# Altium project Tracking_GPS_V1.0.PrjPCB
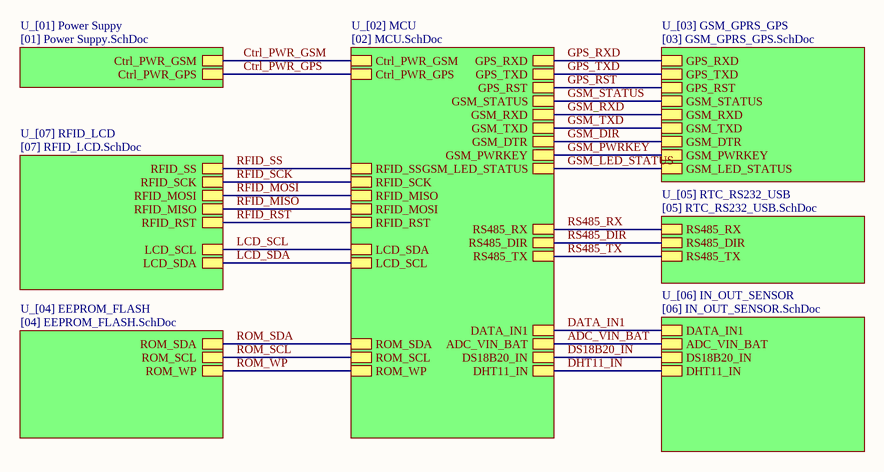
[diagram p0: GPS_Tracking_V1.0.SchDoc]
8 sheets, 174 parts. Net scope: hierarchical (ports join the sheet entries above them; power ports are global).
Board file: PCB1.PcbDoc
Sheets:
  GPS_Tracking_V1.0.SchDoc
    U_[01] Power Suppy = [01] Power Suppy.SchDoc
    U_[03] GSM_GPRS_GPS = [03] GSM_GPRS_GPS.SchDoc
    U_[04] EEPROM_FLASH = [04] EEPROM_FLASH.SchDoc
    U_[05] RTC_RS232_USB = [05] RTC_RS232_USB.SchDoc
    U_[07] RFID_LCD = [07] RFID_LCD.SchDoc
    U_[02] MCU = [02] MCU.SchDoc
    U_[06] IN_OUT_SENSOR = [06] IN_OUT_SENSOR.SchDoc

## Sheet GPS_Tracking_V1.0.SchDoc
size A4

### Sub-sheets
U_[01] Power Suppy = [01] Power Suppy.SchDoc: Ctrl_PWR_GSM, Ctrl_PWR_GPS
U_[02] MCU = [02] MCU.SchDoc: GSM_STATUS, GSM_DTR, GSM_PWRKEY, DATA_IN1, GPS_RXD, GPS_TXD, GPS_RST, Ctrl_PWR_GPS, GSM_RXD, GSM_TXD, Ctrl_PWR_GSM, RS485_TX, RS485_RX, RS485_DIR, ADC_VIN_BAT, DHT11_IN, DS18B20_IN, GSM_LED_STATUS, RFID_SS, RFID_SCK, RFID_MISO, RFID_MOSI, RFID_RST, LCD_SDA, LCD_SCL, ROM_SDA, ROM_SCL, ROM_WP
U_[03] GSM_GPRS_GPS = [03] GSM_GPRS_GPS.SchDoc: GPS_RXD, GPS_TXD, GPS_RST, GSM_STATUS, GSM_RXD, GSM_TXD, GSM_DTR, GSM_PWRKEY, GSM_LED_STATUS
U_[04] EEPROM_FLASH = [04] EEPROM_FLASH.SchDoc: ROM_SDA, ROM_SCL, ROM_WP
U_[05] RTC_RS232_USB = [05] RTC_RS232_USB.SchDoc: RS485_RX, RS485_DIR, RS485_TX
U_[06] IN_OUT_SENSOR = [06] IN_OUT_SENSOR.SchDoc: DATA_IN1, ADC_VIN_BAT, DS18B20_IN, DHT11_IN
U_[07] RFID_LCD = [07] RFID_LCD.SchDoc: RFID_SS, RFID_SCK, RFID_MOSI, RFID_MISO, RFID_RST, LCD_SCL, LCD_SDA

### Nets
ADC_VIN_BAT: sheet U_[02] MCU/ADC_VIN_BAT, sheet U_[06] IN_OUT_SENSOR/ADC_VIN_BAT
Ctrl_PWR_GPS: sheet U_[01] Power Suppy/Ctrl_PWR_GPS, sheet U_[02] MCU/Ctrl_PWR_GPS
Ctrl_PWR_GSM: sheet U_[01] Power Suppy/Ctrl_PWR_GSM, sheet U_[02] MCU/Ctrl_PWR_GSM
DATA_IN1: sheet U_[02] MCU/DATA_IN1, sheet U_[06] IN_OUT_SENSOR/DATA_IN1
DHT11_IN: sheet U_[02] MCU/DHT11_IN, sheet U_[06] IN_OUT_SENSOR/DHT11_IN
DS18B20_IN: sheet U_[02] MCU/DS18B20_IN, sheet U_[06] IN_OUT_SENSOR/DS18B20_IN
GPS_RST: sheet U_[03] GSM_GPRS_GPS/GPS_RST, sheet U_[02] MCU/GPS_RST
GPS_RXD: sheet U_[03] GSM_GPRS_GPS/GPS_RXD, sheet U_[02] MCU/GPS_RXD
GPS_TXD: sheet U_[03] GSM_GPRS_GPS/GPS_TXD, sheet U_[02] MCU/GPS_TXD
GSM_DIR: sheet U_[03] GSM_GPRS_GPS/GSM_DTR, sheet U_[02] MCU/GSM_DTR
GSM_LED_STATUS: sheet U_[03] GSM_GPRS_GPS/GSM_LED_STATUS, sheet U_[02] MCU/GSM_LED_STATUS
GSM_PWRKEY: sheet U_[03] GSM_GPRS_GPS/GSM_PWRKEY, sheet U_[02] MCU/GSM_PWRKEY
GSM_RXD: sheet U_[03] GSM_GPRS_GPS/GSM_RXD, sheet U_[02] MCU/GSM_RXD
GSM_STATUS: sheet U_[03] GSM_GPRS_GPS/GSM_STATUS, sheet U_[02] MCU/GSM_STATUS
GSM_TXD: sheet U_[03] GSM_GPRS_GPS/GSM_TXD, sheet U_[02] MCU/GSM_TXD
LCD_SCL: sheet U_[07] RFID_LCD/LCD_SCL, sheet U_[02] MCU/LCD_SDA
LCD_SDA: sheet U_[07] RFID_LCD/LCD_SDA, sheet U_[02] MCU/LCD_SCL
RFID_MISO: sheet U_[07] RFID_LCD/RFID_MISO, sheet U_[02] MCU/RFID_MOSI
RFID_MOSI: sheet U_[07] RFID_LCD/RFID_MOSI, sheet U_[02] MCU/RFID_MISO
RFID_RST: sheet U_[07] RFID_LCD/RFID_RST, sheet U_[02] MCU/RFID_RST
RFID_SCK: sheet U_[07] RFID_LCD/RFID_SCK, sheet U_[02] MCU/RFID_SCK
RFID_SS: sheet U_[07] RFID_LCD/RFID_SS, sheet U_[02] MCU/RFID_SS
ROM_SCL: sheet U_[04] EEPROM_FLASH/ROM_SCL, sheet U_[02] MCU/ROM_SCL
ROM_SDA: sheet U_[04] EEPROM_FLASH/ROM_SDA, sheet U_[02] MCU/ROM_SDA
ROM_WP: sheet U_[04] EEPROM_FLASH/ROM_WP, sheet U_[02] MCU/ROM_WP
RS485_DIR: sheet U_[05] RTC_RS232_USB/RS485_DIR, sheet U_[02] MCU/RS485_DIR
RS485_RX: sheet U_[05] RTC_RS232_USB/RS485_RX, sheet U_[02] MCU/RS485_RX
RS485_TX: sheet U_[05] RTC_RS232_USB/RS485_TX, sheet U_[02] MCU/RS485_TX

## Sheet [01] Power Suppy.SchDoc
size A4
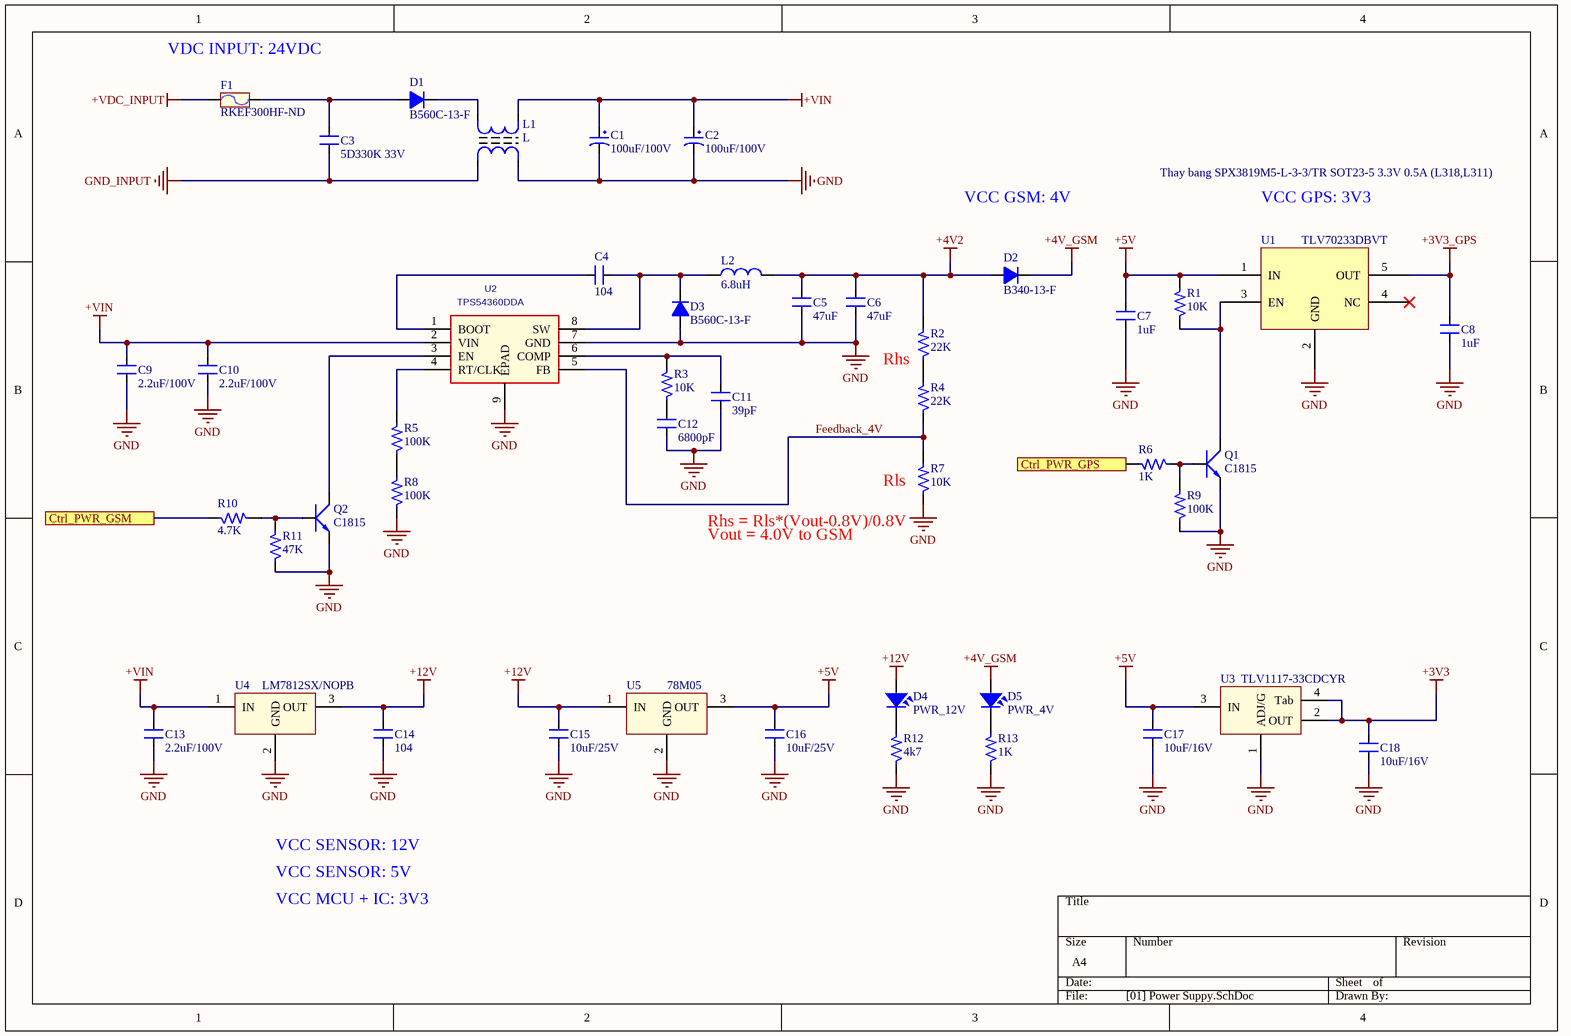
[diagram p1: [01] Power Suppy.SchDoc]

### Parts
C1  100uF/100V  [CP1.5/3.4]
C2  100uF/100V  [CP1.5/3.4]
C3  5D330K 33V  [CN2]
C4  104  [C0603 SMT]
C5  47uF  [SM-1210]
C6  47uF  [SM-1210]
C7  1uF  [SM-1210]
C8  1uF  [SM-1210]
C9  2.2uF/100V  [SM-1210]
C10  2.2uF/100V  [SM-1210]
C11  39pF  [CAP_0805]
C12  6800pF  [CAP_0805]
C13  2.2uF/100V  [SM-1210]
C14  104  [CAP_0805]
C15  10uF/25V  [CAP_0805]
C16  10uF/25V  [CAP_0805]
C17  10uF/16V  [CAP_0805]
C18  10uF/16V  [CAP_0805]
D1  B560C-13-F  [DO-214AB SMC]
D2  B340-13-F  [DO-214AB SMA]
D3  B560C-13-F  [DO-214AB SMC]
D4  PWR_12V  [LED-0805-Yellow]
D5  PWR_4V  [LED-0805-Green]
F1  RKEF300HF-ND  [FUSE2]
L1  L  [L2 UF9.8]
L2  6.8uH  [L01 SMD 12*12*6]
Q1  C1815  [SOT23B]
Q2  C1815  [SOT23B]
R1  10K  [R0603 -SMT]
R2  22K  [RES-SMD-0805]
R3  10K  [RES-SMD-0805]
R4  22K  [RES-SMD-0805]
R5  100K  [RES-SMD-0805]
R6  1K  [R0603 -SMT]
R7  10K  [RES-SMD-0805]
R8  100K  [RES-SMD-0805]
R9  100K  [R0603 -SMT]
R10  4.7K  [RES-SMD-0805]
R11  47K  [RES-SMD-0805]
R12  4k7  [RES-SMD-0805]
R13  1K  [RES-SMD-0805]
U1  TLV70233DBVT  [TLV70233_3.3V]
U2  TPS54360DDA  [DDA8_3P1X2P4-M]
U3  TLV1117-33CDCYR  [SOT223-4N]
U4  LM7812SX/NOPB  [TO-263-4]
U5  78M05  [TO252-3L]

### Ports
Ctrl_PWR_GPS, Ctrl_PWR_GSM

### Nets
+3V3: C18.2 U3.2(OUT) U3.4(Tab)
+3V3_GPS: C8.2 U1.5(OUT)
+4V2: C5.2 C6.2 D2.1(A) L2.2 R2.2
+4V_GSM: D2.2(K) D5.1
+5V: C7.2 C16.2 C17.2 R1.2 U1.1(IN) U3.3(IN) U5.3(OUT)
+12V: C14.2 C15.2 D4.1 U4.3(OUT) U5.1(IN)
+VDC_INPUT: F1.1
+VIN: C1.1 C2.1 C9.2 C10.2 C13.2 L1.3 U2.2(VIN) U4.1(IN)
GND: C1.2 C2.2 C5.1 C6.1 C7.1 C8.1 C9.1 C10.1 C11.1 C12.1 C13.1 C14.1 C15.1 C16.1 C17.1 C18.1 D3.1(A) L1.2 Q1.1(E) Q2.1(E) R7.1 R8.1 R9.1 R11.1 R12.1 R13.1 U1.2(GND) U2.7(GND) U2.9(EPAD) U3.1(ADJ/G) U4.2(GND) U5.2(GND)
GND_INPUT: C3.1 L1.1
Ctrl_PWR_GPS: R6.2 ; port Ctrl_PWR_GPS
Ctrl_PWR_GSM: R10.1 ; port Ctrl_PWR_GSM
Feedback_4V: R4.1 R7.2 U2.5(FB)
NetC3_2: C3.2 D1.1(A) F1.2
NetC4_1: C4.1 U2.1(BOOT)
NetC4_2: C4.2 D3.2(K) L2.1 U2.8(SW)
NetC11_2: C11.2 R3.2 U2.6(COMP)
NetC12_2: C12.2 R3.1
NetD1_2: D1.2(K) L1.4
NetD4_2: D4.2 R12.2
NetD5_2: D5.2 R13.2
NetQ1_2: Q1.2(C) R1.1 U1.3(EN)
NetQ1_3: Q1.3(B) R6.1 R9.2
NetQ2_2: Q2.2(C) U2.3(EN)
NetQ2_3: Q2.3(B) R10.2 R11.2
NetR2_1: R2.1 R4.2
NetR5_1: R5.1 R8.2
NetR5_2: R5.2 U2.4(RT/CLK)

Not connected (* = marked no-connect by the designer): U1 4(NC)*

### Notes on the sheet
- (near F1) VDC INPUT: 24VDC
- Thay bang SPX3819M5-L-3-3/TR SOT23-5 3.3V 0.5A (L318,L311)
- VCC GSM: 4V
- VCC GPS: 3V3
- Rhs
- (near R7) Rls
- (near R7) Rhs = Rls*(Vout-0.8V)/0.8V
- Vout = 4.0V to GSM
- VCC SENSOR: 12V
- VCC SENSOR: 5V
- VCC MCU + IC: 3V3

### Library data of the parts
C1 C2 = CP3: Cap 100uF/35V - 470uF/16V; Value: 100uF/35V/50V; Description 1: 1000uF/6,3V - 470uF/16V - 330uF - 25V; Description 2: 220uF/35V - 100uF/50V - 63V - 4,7uF/200V; Description 3: 22uF => 33uF100V - 3,3uF => 4,7uF/250V; Description 4: 2,2uF =>3,3uF/350 - 2,2uF/400V - 1uF/450V
C3 = CN: Value: 0,1uF/300V; Designed by: VanDungEvn
C4-C8 C11 C12 C14-C18 = CM_1: Cap SMD; Value: 103
C9 C10 C13 = CM: CAP CER 2.2UF 100V X7R 1210  445-4498-2-ND; Value: 103
D1 D3 = D5A: DIODE SCHOTTKY 60V 5A SMC; Value: 1N5408
D2 = D1A: DIODE SCHOTTKY 40V 3A SMC; Value: 1N4007
D4 D5 = LED: LED Single colour Green and Red; Value: LED 3 ly Single Colour
F1 = Fuse: PTC RESET FUSE 60V 3A RADIAL; Designed by: VanDungEvn; Value: Fuse
L1 = L2x220: Inductor; Value: Loc 220; Designed by: VanDungEvn
L2 = L1: FIXED IND 6.2UH 5.7A 22.4 MOHM; Value: 150 mH
Q1 Q2 = C1815: NPN 600mW, ECB; Value: C1815
R1-R5 R7-R12 = RM: Resistor SMD; Value: 1K
R6 R13 = RM: Resistor SMD; Value: 1K
U1 = TLV70233_3.3V
U2 = TPS54360DDA: REG BUCK SPLIT RAIL 8SOPWRPAD; C: Copyright (C) 2015 Accelerated Designs. All rights reserved; Vendor: TEXAS INSTRUMENTS; Built_By: EMA_UL_Team; Value: TPS54360DDA; Manufacturer_Part_Number: TPS54360DDA
U3 = LM1117: 3v3; Value: LM317
U4 = LM78xx_1: Value: LM7805
U5 = LM78xx: On ap +, from + 5 to + 24VDC; Value: LM7805

## Sheet [03] GSM_GPRS_GPS.SchDoc
size A4
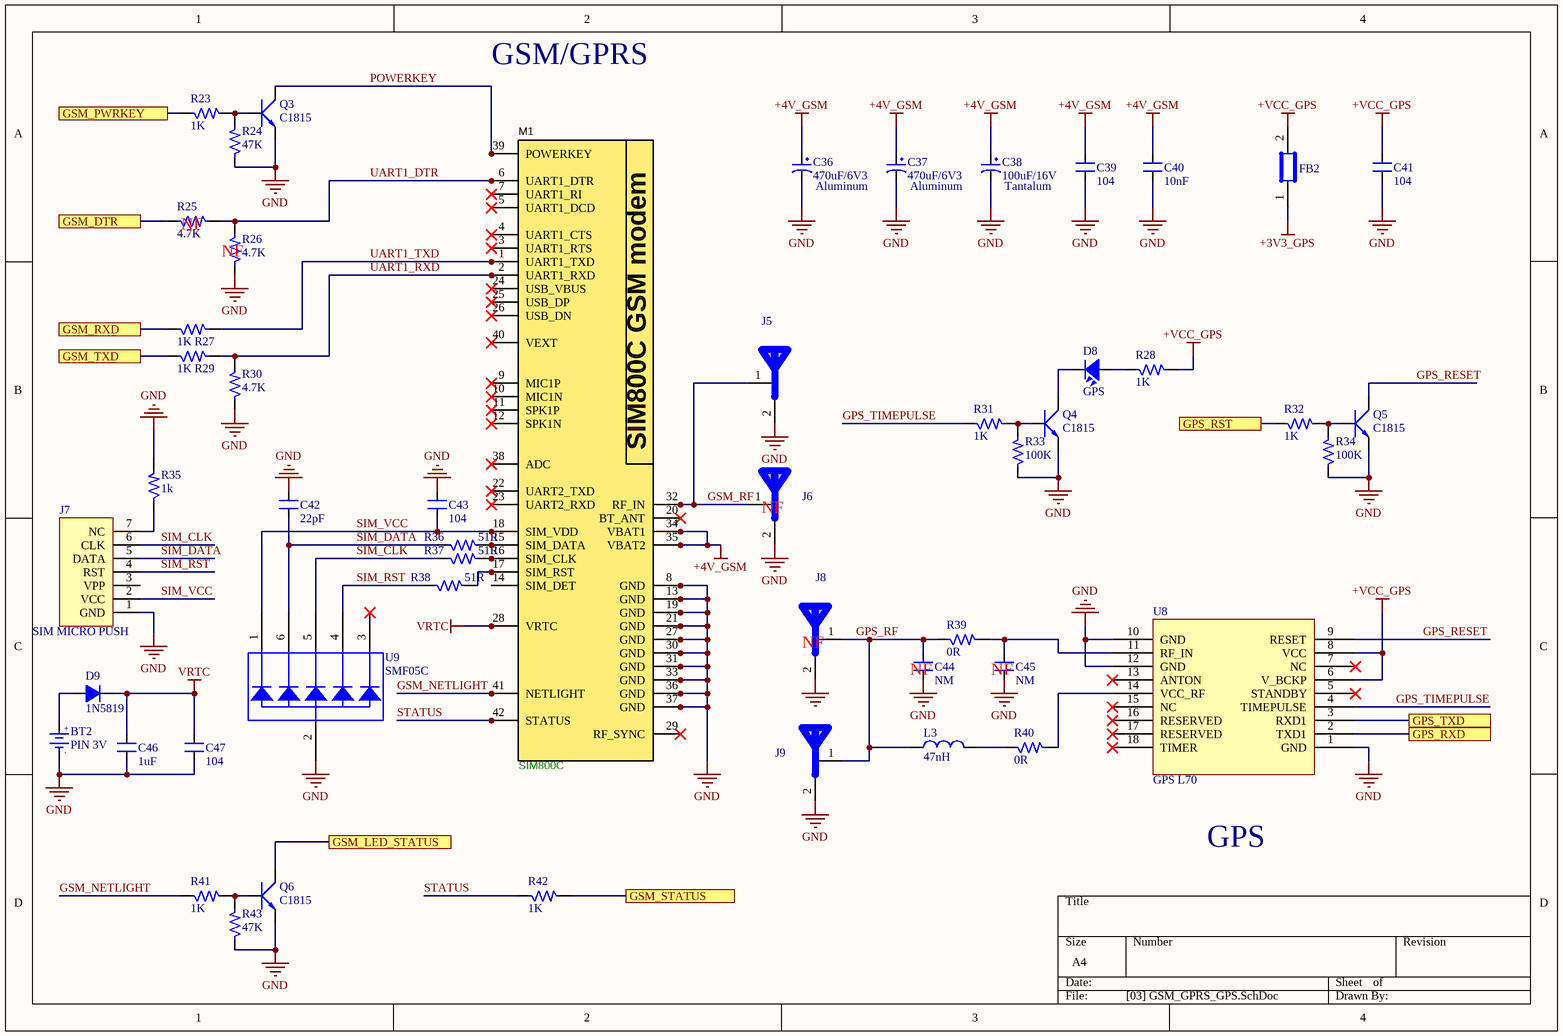
[diagram p2: [03] GSM_GPRS_GPS.SchDoc]

### Parts
(Parts that share a designator on the sheet are numbered #1, #2 ... from top to bottom, then left to right.)
BT2  PIN 3V  [CR1220 SMD]
C36  470uF/6V3  [C_Alu_6.3x7.7]
C37  470uF/6V3  [C_Alu_6.3x7.7]
C38  100uF/16V  [C_7343_40]
C39  104  [CAP_0805]
C40  10nF  [CAP_0805]
C41  104  [CAP_0805]
C42  22pF  [C0603 SMT]
C43  104  [C0603 SMT]
C44  NM  [C0603 SMT]
C45  NM  [C0603 SMT]
C46  1uF  [C0603 SMT]
C47  104  [C0603 SMT]
D8  GPS  [LED-0805-Red]
D9  1N5819  [SOD123]
FB2  BLM21PG600SN1D  [R0805]  (value not drawn)
J5  GPS_ANTENNA  [Antenna-MCX5.08-H5]  (value not drawn)
J6  GSM  [Antenna-IPEX]  (value not drawn)
J7  SIM MICRO PUSH  [MICRO_SIM_HOLDER]
J8  GPS  [Antenna-IPEX]  (value not drawn)
J9#1  GPS_ANTENNA  [Antenna-MCX5.08-H5]  (value not drawn)
L3  47nH  [C0805]
M1  SIM800C  [SIM800C]
Q3  C1815  [SOT23B]
Q4  C1815  [SOT23B]
Q5  C1815  [SOT23B]
Q6  C1815  [SOT23B]
R23  1K  [R0603 -SMT]
R24  47K  [R0603 -SMT]
R25  4.7K  [R0603 -SMT]
R26  4.7K  [R0603 -SMT]
R27  1K  [R0603 -SMT]
R28  1K  [RES-SMD-0805]
R29  1K  [R0603 -SMT]
R30  4.7K  [R0603 -SMT]
R31  1K  [RES-SMD-0805]
R32  1K  [RES-SMD-0805]
R33  100K  [RES-SMD-0805]
R34  100K  [RES-SMD-0805]
R35  1k  [RES-SMD-0805]
R36  51R  [R0603 -SMT]
R37  51R  [R0603 -SMT]
R38  51R  [R0603 -SMT]
R39  0R  [R0603 -SMT]
R40  0R  [R0603 -SMT]
R41  1K  [R0603 -SMT]
R42  1K  [R0603 -SMT]
R43  47K  [R0603 -SMT]
U8  GPS L70  [GPS L70]
U9  SMF05C  [SOT_363_6]

### Ports
GPS_RST, GPS_RXD, GPS_TXD, GSM_DTR, GSM_LED_STATUS, GSM_PWRKEY, GSM_RXD, GSM_STATUS, GSM_TXD

### Nets
+3V3_GPS: FB2.1
+4V_GSM: C36.1 C37.1 C38.1 C39.1 C40.1 M1.34(VBAT1) M1.35(VBAT2)
+VCC_GPS: C41.2 FB2.2 R28.2 U8.6(V_BCKP) U8.8(VCC)
GND: BT2.2(GND) C36.2 C37.2 C38.2 C39.2 C40.2 C41.1 C42.2 C43.2 C44.1 C45.1 C46.1 C47.1 J5.2(GND) J6.2(GND) J7.1(GND) J8.2(GND) J9#1.2(GND) M1.8(GND) M1.13(GND) M1.19(GND) M1.21(GND) M1.27(GND) M1.30(GND) M1.31(GND) M1.33(GND) M1.36(GND) M1.37(GND) Q3.1(E) Q4.1(E) Q5.1(E) Q6.1(E) R24.1 R26.1 R30.1 R33.1 R34.1 R35.2 R43.1 U8.1(GND) U8.10(GND) U8.12(GND) U9.2(A)
VRTC: C46.2 C47.2 D9.2(K) M1.28(VRTC)
GPS_RESET: Q5.2(C) U8.9(RESET)
GPS_RF: C44.2 J8.1(GND) J9#1.1(GND) L3.1 R39.1
GPS_RST: R32.1 ; port GPS_RST
GPS_RXD: U8.2(TXD1) ; port GPS_RXD
GPS_TIMEPULSE: R31.1 U8.4(TIMEPULSE)
GPS_TXD: U8.3(RXD1) ; port GPS_TXD
GSM_DIR: R25.1 ; port GSM_DTR
GSM_LED_STATUS: Q6.2(C) ; port GSM_LED_STATUS
GSM_NETLIGHT: M1.41(NETLIGHT) R41.1
GSM_PWRKEY: R23.1 ; port GSM_PWRKEY
GSM_RF: J5.1(GND) J6.1(GND) M1.32(RF_IN)
GSM_RXD: R27.1 ; port GSM_RXD
GSM_STATUS: R42.2 ; port GSM_STATUS
GSM_TXD: R29.1 ; port GSM_TXD
POWERKEY: M1.39(POWERKEY) Q3.2(C)
SIM_CLK: J7.6(CLK) R37.1 U9.5(K4)
SIM_DATA: C42.1 J7.5(DATA) R36.1 U9.6(K5)
SIM_RST: J7.4(RST) R38.1 U9.4(K3)
SIM_VCC: C43.1 J7.2(VCC) M1.18(SIM_VDD) U9.1(K1)
STATUS: M1.42(STATUS) R42.1
UART1_DTR: M1.6(UART1_DTR) R25.2 R26.2
UART1_RXD: M1.2(UART1_RXD) R29.2 R30.2
UART1_TXD: M1.1(UART1_TXD) R27.2
NetBT2_1: BT2.1(+3V) D9.1(A)
NetC45_2: C45.2 R39.2 U8.11(RF_IN)
NetD8_1: D8.1 R28.1
NetD8_2: D8.2 Q4.2(C)
NetJ7_7: J7.7(NC) R35.1
NetL3_2: L3.2 R40.1
NetM1_15: M1.15(SIM_DATA) R36.2
NetM1_16: M1.16(SIM_CLK) R37.2
NetM1_17: M1.17(SIM_RST) R38.2
NetQ3_3: Q3.3(B) R23.2 R24.2
NetQ4_3: Q4.3(B) R31.2 R33.2
NetQ5_3: Q5.3(B) R32.2 R34.2
NetQ6_3: Q6.3(B) R41.2 R43.2
NetR40_2: R40.2 U8.14(VCC_RF)

Not connected (* = marked no-connect by the designer): J7 3(VPP); M1 3(UART1_RTS)* 4(UART1_CTS)* 5(UART1_DCD)* 7(UART1_RI)* 9(MIC1P)* 10(MIC1N)* 11(SPK1P)* 12(SPK1N)* 14(SIM_DET) 20(BT_ANT)* 22(UART2_TXD)* 23(UART2_RXD)* 24(USB_VBUS)* 25(USB_DP)* 26(USB_DN)* 29(RF_SYNC)* 38(ADC)* 40(VEXT)*; U8 5(STANDBY)* 7(NC)* 13(ANTON)* 15(NC)* 16(RESERVED)* 17(RESERVED)* 18(TIMER)*; U9 3(K2)*

### Notes on the sheet
- GSM/GPRS
- (near R25) NF
- (near C36) Aluminum
- (near C37) Aluminum
- (near C38) Tantalum
- (near R26) NF
- (near J6) NF
- (near J8) NF
- (near C44) NF
- (near C45) NF
- GPS
- (in symbol PIN 3V) +; -
- (in symbol SIM800C) SIM800C GSM modem

### Library data of the parts
BT2 = PIN 3V: Battery 3VDC; Value: PIN 3V
C36 C37 = C-Alu-Tantalum: Cap Aluminum; Value: 10uF/50V; Description 1: 10 => 220uF/6,3V/10V - 10uF => 100uF/16V; Description 2: 0,1uF => 33uF/50V - 10uF => 22uF/63V; Description 3: 0,47uF => 10uF/100V
C38 = C-Alu-Tantalum: Cap Tantalum 7343; Value: 10uF/50V; Description 1: 10 => 220uF/6,3V/10V - 10uF => 100uF/16V; Description 2: 0,1uF => 33uF/50V - 10uF => 22uF/63V; Description 3: 0,47uF => 10uF/100V
C39-C47 = CM: Cap SMD; Value: 103
D8 = LED: as D4 on sheet [01] Power Suppy
D9 = D1A: Diode 1A; Value: 1N4007
FB2 = Ferrite Bead
J5 J6 J8 J9#1 = ANTEN
L3 = L1: Inductor; Value: 150 mH
Q3-Q6 = C1815: NPN 600mW, ECB; Value: C1815
R23 R27-R29 R31 R32 R35 R41 R42 = RM: Resistor SMD; Value: 1K
R24-R26 R30 R33 R34 R36-R40 R43 = RM: Resistor SMD; Value: 1K
U9 = SMF05C: ESD Protection

## Sheet [04] EEPROM_FLASH.SchDoc
size A4
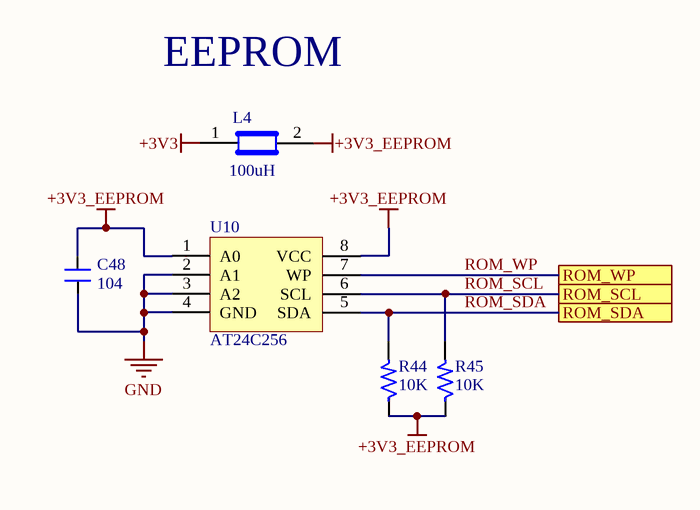
[diagram p3: [04] EEPROM_FLASH.SchDoc]

### Parts
C48  104  [C0603 SMT]
L4  100uH  [R0805]
R44  10K  [R0603 -SMT]
R45  10K  [R0603 -SMT]
U10  AT24C256  [SO-8]

### Ports
ROM_SCL, ROM_SDA, ROM_WP

### Nets
+3V3: L4.1
+3V3_EEPROM: C48.2 L4.2 R44.1 R45.1 U10.1(A0) U10.8(VCC)
GND: C48.1 U10.2(A1) U10.3(A2) U10.4(GND)
ROM_SCL: R45.2 U10.6(SCL) ; port ROM_SCL
ROM_SDA: R44.2 U10.5(SDA) ; port ROM_SDA
ROM_WP: U10.7(WP) ; port ROM_WP

### Notes on the sheet
- (near L4) EEPROM

### Library data of the parts
C48 = CM: Cap SMD; Value: 103
L4 = Ferrite Bead: 100uH 0805
R44 R45 = RM: Resistor SMD; Value: 1K
U10 = AT24Cxx

## Sheet [05] RTC_RS232_USB.SchDoc
size A4
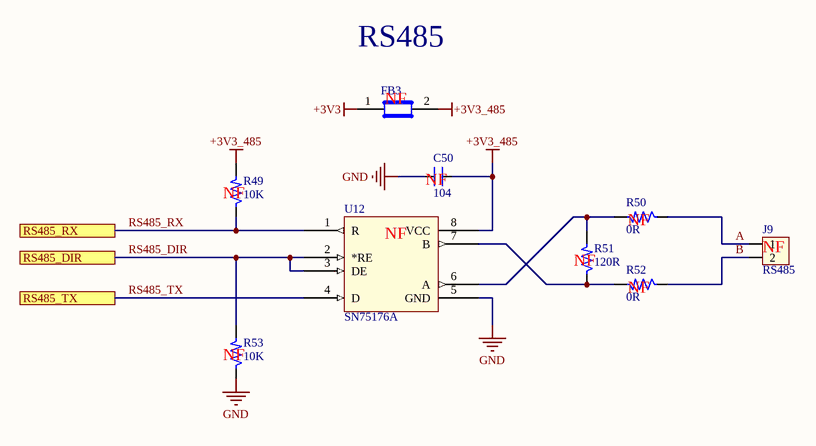
[diagram p4: [05] RTC_RS232_USB.SchDoc]

### Parts
(Parts that share a designator on the sheet are numbered #1, #2 ... from top to bottom, then left to right.)
C50  104  [CAP_0805]
FB3  BLM21PG600SN1D  [R0805]  (value not drawn)
J9#2  RS485  [Hed2V_3.96]
R49  10K  [RES-SMD-0805]
R50  0R  [RES-SMD-0805]
R51  120R  [RES-SMD-0805]
R52  0R  [RES-SMD-0805]
R53  10K  [RES-SMD-0805]
U12  SN75176A  [SN75176A]

### Ports
RS485_DIR, RS485_RX, RS485_TX

### Nets
+3V3: FB3.1
+3V3_485: C50.2 FB3.2 R49.2 U12.8(VCC)
GND: C50.1 R53.1 U12.5(GND)
A: J9#2.1 R50.1
B: J9#2.2 R52.1
RS485_DIR: R53.2 U12.2(*RE) U12.3(DE) ; port RS485_DIR
RS485_RX: R49.1 U12.1(R) ; port RS485_RX
RS485_TX: U12.4(D) ; port RS485_TX
NetR50_2: R50.2 R51.2 U12.6(A)
NetR51_1: R51.1 R52.2 U12.7(B)

### Notes on the sheet
- RS485
- (near FB3) NF
- (near R49) NF
- (near U12) NF
- (near C50) NF
- (near R50) NF
- (near R51) NF
- (near R52) NF
- (near J9#2) NF
- (near R53) NF

### Library data of the parts
C50 = CM: Cap SMD; Value: 103
FB3 = Ferrite Bead
J9#2 = Hed2: Header 2 (Green); Value: Header 2
R49-R53 = RM: Resistor SMD; Value: 1K

## Sheet [07] RFID_LCD.SchDoc
size A4
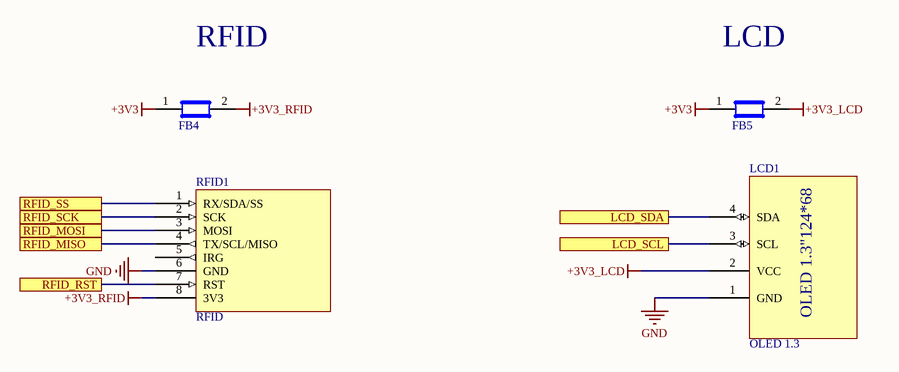
[diagram p5: [07] RFID_LCD.SchDoc]

### Parts
FB4  BLM21PG600SN1D  [R0805]  (value not drawn)
FB5  BLM21PG600SN1D  [R0805]  (value not drawn)
LCD1  OLED 1.3  [OLED 1.3]
RFID1  RFID  [RFID RC522]

### Ports
LCD_SCL, LCD_SDA, RFID_MISO, RFID_MOSI, RFID_RST, RFID_SCK, RFID_SS

### Nets
+3V3: FB4.1 FB5.1
+3V3_LCD: FB5.2 LCD1.2(VCC)
+3V3_RFID: FB4.2 RFID1.8(3V3)
GND: LCD1.1(GND) RFID1.6(GND)
LCD_SCL: LCD1.3(SCL) ; port LCD_SCL
LCD_SDA: LCD1.4(SDA) ; port LCD_SDA
RFID_MISO: RFID1.4(TX/SCL/MISO) ; port RFID_MISO
RFID_MOSI: RFID1.3(MOSI) ; port RFID_MOSI
RFID_RST: RFID1.7(RST) ; port RFID_RST
RFID_SCK: RFID1.2(SCK) ; port RFID_SCK
RFID_SS: RFID1.1(RX/SDA/SS) ; port RFID_SS

Not connected (* = marked no-connect by the designer): RFID1 5(IRG)

### Notes on the sheet
- RFID
- LCD
- (in symbol OLED 1.3) OLED 1.3"124*68

### Library data of the parts
FB4 FB5 = Ferrite Bead
RFID1 = RFID RC522

## Sheet [02] MCU.SchDoc
size A4
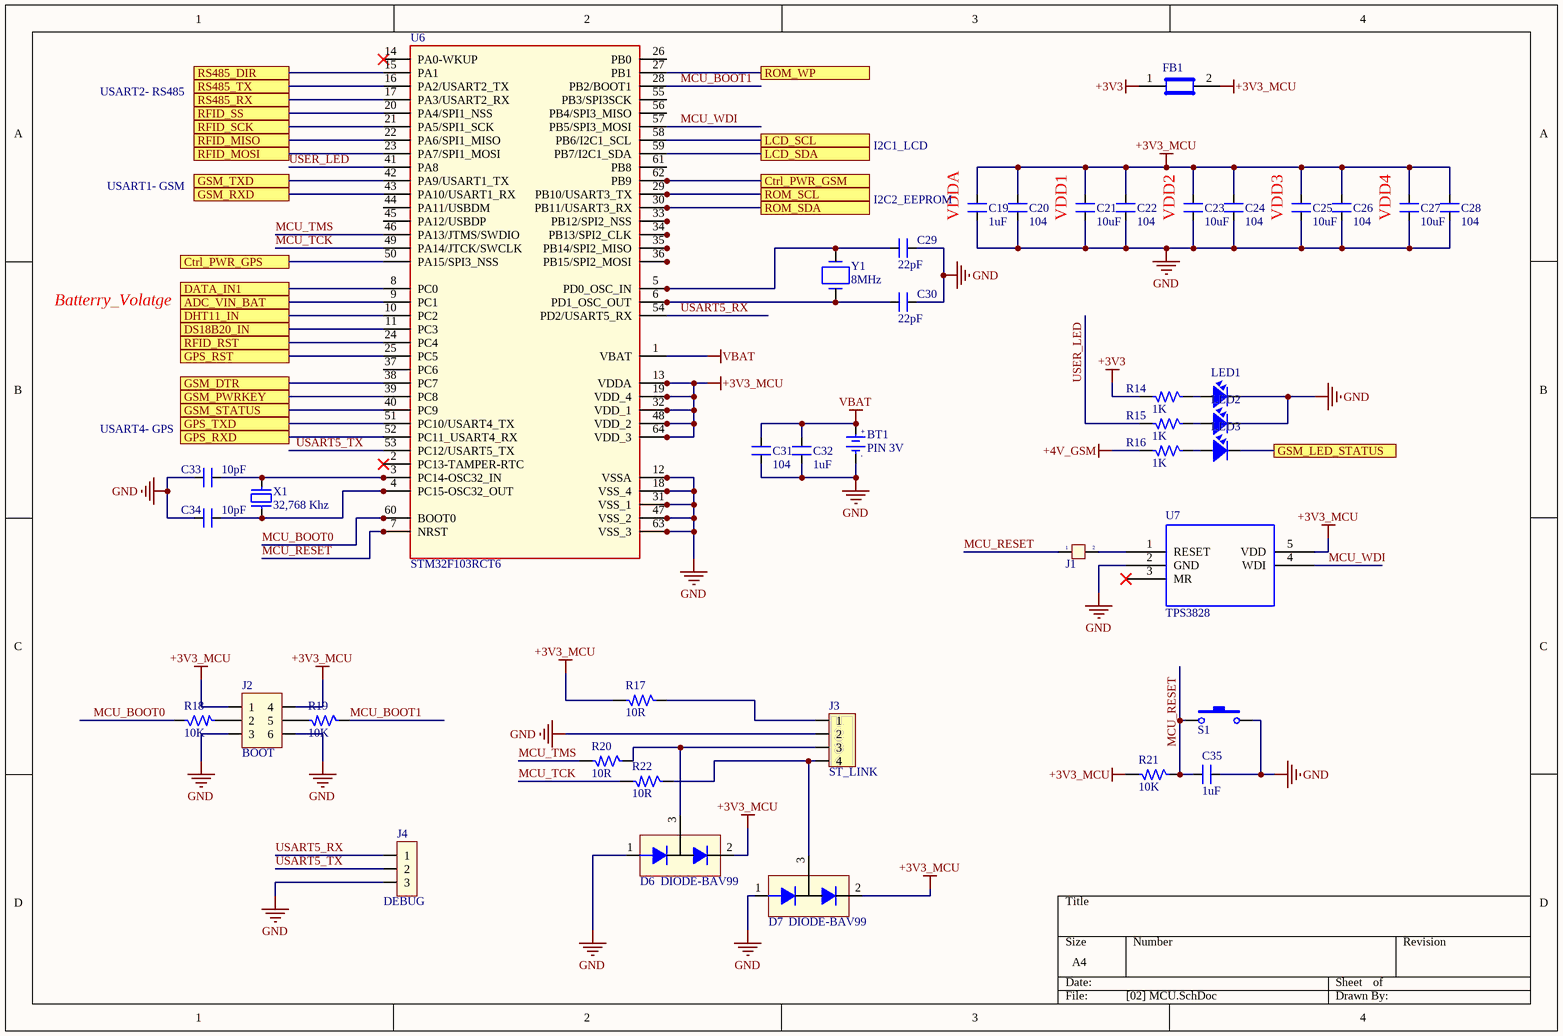
[diagram p6: [02] MCU.SchDoc]

### Parts
BT1  PIN 3V  [CR1220 SMD]
C19  1uF  [C0603 SMT]
C20  104  [C0603 SMT]
C21  10uF  [C0603 SMT]
C22  104  [C0603 SMT]
C23  10uF  [C0603 SMT]
C24  104  [C0603 SMT]
C25  10uF  [C0603 SMT]
C26  104  [C0603 SMT]
C27  10uF  [C0603 SMT]
C28  104  [C0603 SMT]
C29  22pF  [C0603 SMT]
C30  22pF  [C0603 SMT]
C31  104  [C0603 SMT]
C32  1uF  [C0603 SMT]
C33  10pF  [C0603 SMT]
C34  10pF  [C0603 SMT]
C35  1uF  [CAP_0805]
D6  DIODE-BAV99  [SOT23]
D7  DIODE-BAV99  [SOT23]
FB1  BLM21PG600SN1D  [R0805]  (value not drawn)
J1  watdog  [JP2]  (value not drawn)
J2  BOOT  [JP3x2]
J3  ST_LINK  [CON_4P]
J4  DEBUG  [JP3]
LED1  LED  [LED-0805-Green]  (value not drawn)
LED2  LED  [LED-0805-Yellow]  (value not drawn)
LED3  LED  [LED-0805-Red]  (value not drawn)
R14  1K  [RES-SMD-0805]
R15  1K  [RES-SMD-0805]
R16  1K  [RES-SMD-0805]
R17  10R  [RES-SMD-0805]
R18  10K  [R0603 -SMT]
R19  10K  [R0603 -SMT]
R20  10R  [RES-SMD-0805]
R21  10K  [RES-SMD-0805]
R22  10R  [RES-SMD-0805]
S1  SW-SMD  [SW-SMD]  (value not drawn)
U6  STM32F103RCT6  [LQFP-64]
U7  TPS3828  [TPS3828]
X1  32,768 Khz  [XT32kn]
Y1  8MHz  [ABM7_v1_1_BIG]

### Ports
ADC_VIN_BAT, Ctrl_PWR_GPS, Ctrl_PWR_GSM, DATA_IN1, DHT11_IN, DS18B20_IN, GPS_RST, GPS_RXD, GPS_TXD, GSM_DTR, GSM_LED_STATUS, GSM_PWRKEY, GSM_RXD, GSM_STATUS, GSM_TXD, LCD_SCL, LCD_SDA, RFID_MISO, RFID_MOSI, RFID_RST, RFID_SCK, RFID_SS, ROM_SCL, ROM_SDA, ROM_WP, RS485_DIR, RS485_RX, RS485_TX

### Nets
+3V3: FB1.1 R14.2
+3V3_MCU: C19.2 C20.2 C21.2 C22.2 C23.2 C24.2 C25.2 C26.2 C27.2 C28.2 D6.2 D7.2 FB1.2 J2.1 J2.4 R17.2 R21.2 U6.13(VDDA) U6.19(VDD_4) U6.32(VDD_1) U6.48(VDD_2) U6.64(VDD_3) U7.5(VDD)
+4V_GSM: R16.2
GND: BT1.2(GND) C19.1 C20.1 C21.1 C22.1 C23.1 C24.1 C25.1 C26.1 C27.1 C28.1 C29.2 C30.2 C31.1 C32.1 C33.2 C34.2 C35.2 D6.1 D7.1 J2.3 J2.6 J3.2 J4.3 LED1.2 LED2.2 S1.2 U6.12(VSSA) U6.18(VSS_4) U6.31(VSS_1) U6.47(VSS_2) U6.63(VSS_3) U7.2(GND)
VBAT: BT1.1(+3V) C31.2 C32.2 U6.1(VBAT)
ADC_VIN_BAT: U6.9(PC1) ; port ADC_VIN_BAT
Ctrl_PWR_GPS: U6.50(PA15/SPI3_NSS) ; port Ctrl_PWR_GPS
Ctrl_PWR_GSM: U6.62(PB9) ; port Ctrl_PWR_GSM
DATA_IN1: U6.8(PC0) ; port DATA_IN1
DHT11_IN: U6.10(PC2) ; port DHT11_IN
DS18B20_IN: U6.11(PC3) ; port DS18B20_IN
GPS_RST: U6.25(PC5) ; port GPS_RST
GPS_RXD: U6.52(PC11_USART4_RX) ; port GPS_RXD
GPS_TXD: U6.51(PC10/USART4_TX) ; port GPS_TXD
GSM_DIR: U6.38(PC7) ; port GSM_DTR
GSM_LED_STATUS: LED3.2 ; port GSM_LED_STATUS
GSM_PWRKEY: U6.39(PC8) ; port GSM_PWRKEY
GSM_RXD: U6.43(PA10/USART1_RX) ; port GSM_RXD
GSM_STATUS: U6.40(PC9) ; port GSM_STATUS
GSM_TXD: U6.42(PA9/USART1_TX) ; port GSM_TXD
LCD_SCL: U6.59(PB7/I2C1_SDA) ; port LCD_SDA
LCD_SDA: U6.58(PB6/I2C1_SCL) ; port LCD_SCL
MCU_BOOT0: R18.1 U6.60(BOOT0)
MCU_BOOT1: R19.1 U6.28(PB2/BOOT1)
MCU_RESET: C35.1 J1.1 R21.1 S1.1 U6.7(NRST)
MCU_TCK: R22.2 U6.49(PA14/JTCK/SWCLK)
MCU_TMS: R20.2 U6.46(PA13/JTMS/SWDIO)
MCU_WDI: U6.57(PB5/SPI3_MOSI) U7.4(WDI)
RFID_MISO: U6.23(PA7/SPI1_MOSI) ; port RFID_MOSI
RFID_MOSI: U6.22(PA6/SPI1_MISO) ; port RFID_MISO
RFID_RST: U6.24(PC4) ; port RFID_RST
RFID_SCK: U6.21(PA5/SPI1_SCK) ; port RFID_SCK
RFID_SS: U6.20(PA4/SPI1_NSS) ; port RFID_SS
ROM_SCL: U6.29(PB10/USART3_TX) ; port ROM_SCL
ROM_SDA: U6.30(PB11/USART3_RX) ; port ROM_SDA
ROM_WP: U6.27(PB1) ; port ROM_WP
RS485_DIR: U6.15(PA1) ; port RS485_DIR
RS485_RX: U6.17(PA3/USART2_RX) ; port RS485_RX
RS485_TX: U6.16(PA2/USART2_TX) ; port RS485_TX
USART5_RX: J4.1 U6.54(PD2/USART5_RX)
USART5_TX: J4.2 U6.53(PC12/USART5_TX)
USER_LED: R15.2 U6.41(PA8)
NetC29_1: C29.1 U6.5(PD0_OSC_IN) Y1.2
NetC30_1: C30.1 U6.6(PD1_OSC_OUT) Y1.1
NetC33_1: C33.1 U6.3(PC14-OSC32_IN) X1.1
NetC34_1: C34.1 U6.4(PC15-OSC32_OUT) X1.2
NetD6_3: D6.3 J3.3 R20.1
NetD7_3: D7.3 J3.4 R22.1
NetJ1_2: J1.2 U7.1(RESET)
NetJ2_2: J2.2 R18.2
NetJ2_5: J2.5 R19.2
NetJ3_1: J3.1 R17.1
NetLED1_1: LED1.1 R14.1
NetLED2_1: LED2.1 R15.1
NetLED3_1: LED3.1 R16.1

Not connected (* = marked no-connect by the designer): U6 2(PC13-TAMPER-RTC)* 14(PA0-WKUP)* 26(PB0) 33(PB12/SPI2_NSS) 34(PB13/SPI2_CLK) 35(PB14/SPI2_MISO) 36(PB15/SPI2_MOSI) 37(PC6) 44(PA11/USBDM) 45(PA12/USBDP) 55(PB3/SPI3SCK) 56(PB4/SPI3_MISO) 61(PB8); U7 3(MR)*

### Notes on the sheet
- USART2- RS485
- I2C1_LCD
- USART1- GSM
- I2C2_EEPROM
- (near C19) VDDA
- (near C21) VDD1
- (near C23) VDD2
- (near C25) VDD3
- (near C27) VDD4
- Batterry_Volatge
- USART4- GPS
- (in symbol PIN 3V) +; -

### Library data of the parts
BT1 = PIN 3V: Battery 3VDC; Value: PIN 3V
C19-C35 = CM: Cap SMD; Value: 103
D6 D7 = DIODE-BAV99: ZENER, SOT23,; Manufacturer: ON Semiconductor / Fairchild; Manufacturer Part Number: BAV99; .Creator: LeKhaLinh; Other Drawings: Diode Circuit; PCN Design/Specification: Mold Compound 12/Dec/2007; PCN Assembly/Origin: SOT23 Manufacturing Source 31/May2013 / Assembly Site Addition 20/Jul/2015; PCN Packaging: Binary Year Code Marking 15/Jan/2014; Diode Configuration: 1 Pair Series Connection; Diode Type: Standard; Voltage - DC Reverse (Vr) (Max): 70V; Current - Average Rectified (Io) (per Diode): 200mA; Voltage - Forward (Vf) (Max) @ If: 1.25V @ 150mA; Speed: Small Signal =; Reverse Recovery Time (trr): 6ns; Current - Reverse Leakage @ Vr: 2.5µA @ 70V; Online Catalog: Diode Array; Other Names: BAV99FSDKR; .CheckPCB: LeKhaLinh; .CheckSCH: LeKhaLinh; Supplier 1: Digi-Key; Stock 1: 1165; Pricing 1: 1=0.26, 10=0.21, 100=0.1115, 500=0.0734, 1000=0.0499 (USD); Standard Package: 1; Category: Discrete Semiconductor Products; Family: Diodes, Rectifiers - Arrays; Packaging: Digi-Reel®; Mounting Type: Surface Mount; Package / Case: TO-236-3, SC-59, SOT-23-3; Supplier Device Package: SOT-23-3 (TO-236); ComponentLink1URL: https://www.fairchildsemi.com/package-drawings/MA/MA03B.pdf?src-supplier=Digi-Key; ComponentLink1Description: https://www.fairchildsemi.com/package-drawings/MA/MA03B.pdf?src-supplier=Digi-Key; ComponentLink2URL: http://www.farnell.com/datasheets/1822674.pdf?src-supplier=Element14; ComponentLink2Description: http://www.farnell.com/datasheets/1822674.pdf?src-supplier=Element14; ComponentLink3URL: http://www.mouser.com/ds/2/149/BAV99-22788.pdf?src-supplier=Mouser; ComponentLink3Description: http://www.mouser.com/ds/2/149/BAV99-22788.pdf?src-supplier=Mouser; ComponentLink4URL: http://www.fairchildsemi.com/ds/BA/BAV99.pdf?src-supplier=Avnet+Europe; ComponentLink4Description: http://www.fairchildsemi.com/ds/BA/BAV99.pdf?src-supplier=Avnet+Europe; ComponentLink5URL: https://www.verical.com/server-webapp/html/getDatasheet?partID=110217&src-supplier=Verical; ComponentLink5Description: https://www.verical.com/server-webapp/html/getDatasheet?partID=110217&src-supplier=Verical; ComponentLink6URL: http://www.farnell.com/datasheets/2304409.pdf?src-supplier=Element14; ComponentLink6Description: http://www.farnell.com/datasheets/2304409.pdf?src-supplier=Element14; Supplier 2: Mouser; Stock 2: 0; Supplier 3: Arrow; Stock 3: 5700; Pricing 3: 1=0.1933, 10=0.1873, 25=0.1555, 100=0.0806, 250=0.0724, 500=0.0523, 1000=0.0428, 3000=0.0342 (USD); Supplier Part Number 1: BAV99FSCT-ND; Supplier Part Number 2: 512-BAV99; Supplier Part Number 3: BAV99
FB1 = Ferrite Bead
J1 = JP 2: Jumper 2; Value: JP 2
J2 = JP3x2: Connector 3x2; Value: Connector 3x2
J3 = Header4: Header IDC, 4 x 1 Pin Vertical 2.54mm Pitch (Non-Boxed, Male); Manufacturer: W¨¹rth Elektronik eiSos GmbH; partNo: 613002143121; ComponentLink1 Description: Manufacturer; ComponentLink2 Description: Datasheet; NoPins: 02; Created Date: 29 March 2013; ComponentLink1URL: http://www.we-online.com; ComponentLink2URL: http://katalog.we-online.de/em/datasheet/6130xx143121.pdf; Created by: Karrer Zheng
J4 = JP3: Jumper 3; Value: J3
LED1-LED3 = LED: as D4 on sheet [01] Power Suppy
R14-R16 = RM: Resistor SMD; Value: 1K
R17-R22 = RM: Resistor SMD; Value: 1K
S1 = SW-SMD: Switch; Published: 24-Mar-1999; LatestRevisionDate: 17-Jul-2002; LatestRevisionNote: Re-released for DXP Platform.; PackageReference: SPST-2; Publisher: Altium Limited
U6 = STM32F103RCT6: MCU 32BIT 256KB FLASH 64LQFP
X1 = XT32k: Crystal 32,768kHz for timer real; Value: 32,768khz
Y1 = ABM7-16.000MHZ-D2Y-T: CRYSTAL 16MHZ 18PF SMD; Manufacturer: Abracon LLC; Frequency Stability: ±30ppm; Frequency Tolerance: ±20ppm; ESR (Equivalent Series Resistance): 50 Ohm; Operating Mode: Fundamental; .Creator: MM; .Checked PCB: RF; Supplier 1: Digi-Key; Manufacturer Part Number: ABM7-16.000MHZ-D2Y-T; RoHS: RoHS Compliant; Category: Crystals and Oscillators; Stock 1: 5861; Pricing 1: 1=0.96, 10=0.847, 50=0.791, 100=0.7, 500=0.6615 (USD); Packaging: Cut Tape (CT); Type: MHz Crystal; Frequency: 16MHz; Load Capacitance: 18pF; Operating Temperature: -40°C ~ 85°C; Ratings: -; Mounting Type: Surface Mount; Package / Case: 2-SMD; Size / Dimension: 0.236" L x 0.138" W (6.00mm x 3.50mm); Height: 0.055" (1.40mm); ComponentLink1URL: http://www.abracon.com/Resonators/abm7.pdf; ComponentLink1Description: http://www.abracon.com/Resonators/abm7.pdf; Supplier Part Number 1: 535-9840-1-ND; .Checked SCH: RF

## Sheet [06] IN_OUT_SENSOR.SchDoc
size A4
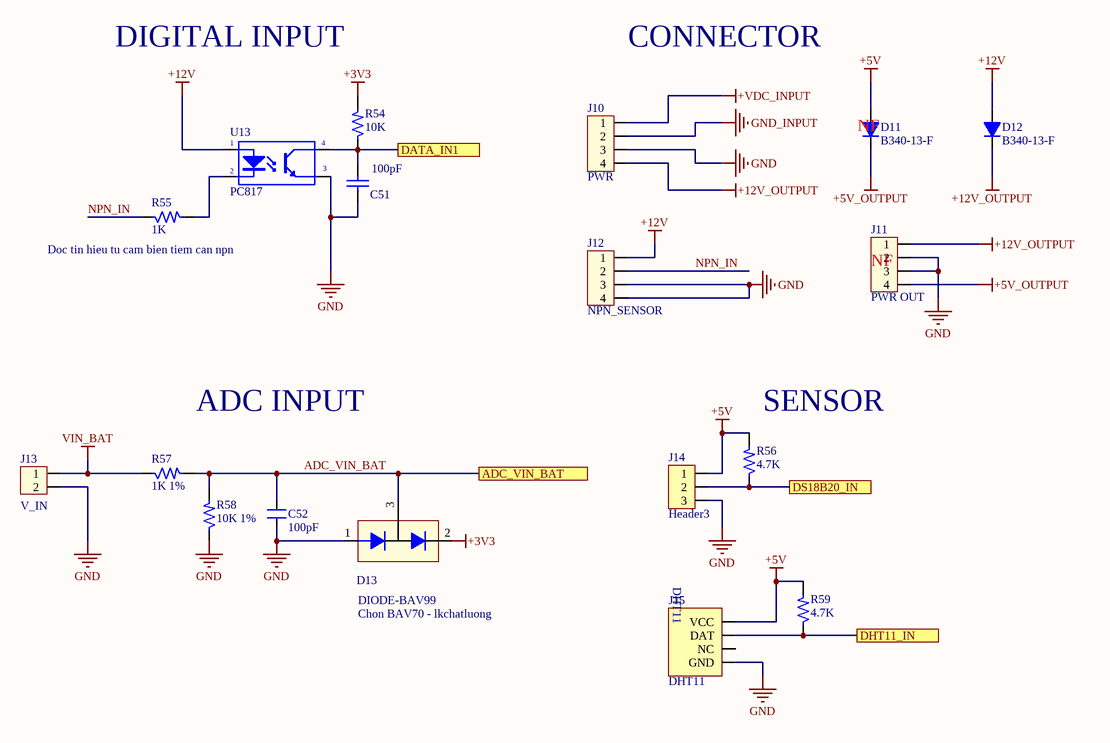
[diagram p7: [06] IN_OUT_SENSOR.SchDoc]

### Parts
C51  100pF  [CAP_0805]
C52  100pF  [CAP_0805]
D11  B340-13-F  [DO-214AB SMA]
D12  B340-13-F  [DO-214AB SMA]
D13  DIODE-BAV99  [SOT23]
J10  PWR  [Hed4V_3.96]
J11  PWR OUT  [CON_2.54mm_4]
J12  NPN_SENSOR  [CON_2.54mm_4]
J13  V_IN  [CON_2.54mm_2]
J14  Header3  [Header3]
J15  DHT11  [DHT11]
R54  10K  [RES-SMD-0805]
R55  1K  [RES-SMD-0805]
R56  4.7K  [RES-SMD-0805]
R57  1K 1%  [RES-SMD-0805]
R58  10K 1%  [RES-SMD-0805]
R59  4.7K  [RES-SMD-0805]
U13  PC817  [DIP4/W0.3]

### Ports
ADC_VIN_BAT, DATA_IN1, DHT11_IN, DS18B20_IN

### Nets
+3V3: D13.2 R54.2
+5V: D11.1(A) J14.1 J15.1(VCC) R56.2 R59.2
+5V_OUTPUT: D11.2(K) J11.4
+12V: D12.1(A) J12.1 U13.1(A)
+12V_OUTPUT: D12.2(K) J10.4 J11.1
+VDC_INPUT: J10.1
GND: C51.2 C52.1 D13.1 J10.3 J11.2 J11.3 J12.3 J12.4 J13.2 J14.3 J15.4(GND) R58.1 U13.3(E)
GND_INPUT: J10.2
VIN_BAT: J13.1 R57.1
ADC_VIN_BAT: C52.2 D13.3 R57.2 R58.2 ; port ADC_VIN_BAT
DATA_IN1: C51.1 R54.1 U13.4(C) ; port DATA_IN1
DHT11_IN: J15.2(DAT) R59.1 ; port DHT11_IN
DS18B20_IN: J14.2 R56.1 ; port DS18B20_IN
NPN_IN: J12.2 R55.1
NetR55_2: R55.2 U13.2(K)

Not connected (* = marked no-connect by the designer): J15 3(NC)

### Notes on the sheet
- DIGITAL INPUT
- CONNECTOR
- (near D11) NF
- (near R55) Doc tin hieu tu cam bien tiem can npn
- (near J11) NF
- ADC INPUT
- (near R56) SENSOR
- Chon BAV70 - lkchatluong

### Library data of the parts
C51 = CapSMD: Capacitor; Value: 33p; Published: 8-Jun-2000; LatestRevisionDate: 17-Jul-2002; LatestRevisionNote: Re-released for DXP Platform.; PackageReference: RAD-0.3; Publisher: Altium Limited
C52 = CM: Cap SMD; Value: 103
D11 D12 = D1A: Diode 1A; Value: 1N4007
D13 = DIODE-BAV99: as D6 on sheet [02] MCU; .CheckPCB: LeKhaLinh; .CheckSCH: LeKhaLinh; Supplier 1: Digi-Key; Stock 1: 1165; Pricing 1: 1=0.26, 10=0.21, 100=0.1115, 500=0.0734, 1000=0.0499 (USD); Standard Package: 1; Category: Discrete Semiconductor Products; Family: Diodes, Rectifiers - Arrays; Packaging: Digi-Reel®; Mounting Type: Surface Mount; Package / Case: TO-236-3, SC-59, SOT-23-3; Supplier Device Package: SOT-23-3 (TO-236); ComponentLink1URL: https://www.fairchildsemi.com/package-drawings/MA/MA03B.pdf?src-supplier=Digi-Key; ComponentLink1Description: https://www.fairchildsemi.com/package-drawings/MA/MA03B.pdf?src-supplier=Digi-Key; ComponentLink2URL: http://www.farnell.com/datasheets/1822674.pdf?src-supplier=Element14; ComponentLink2Description: http://www.farnell.com/datasheets/1822674.pdf?src-supplier=Element14; ComponentLink3URL: http://www.mouser.com/ds/2/149/BAV99-22788.pdf?src-supplier=Mouser; ComponentLink3Description: http://www.mouser.com/ds/2/149/BAV99-22788.pdf?src-supplier=Mouser; ComponentLink4URL: http://www.fairchildsemi.com/ds/BA/BAV99.pdf?src-supplier=Avnet+Europe; ComponentLink4Description: http://www.fairchildsemi.com/ds/BA/BAV99.pdf?src-supplier=Avnet+Europe; ComponentLink5URL: https://www.verical.com/server-webapp/html/getDatasheet?partID=110217&src-supplier=Verical; ComponentLink5Description: https://www.verical.com/server-webapp/html/getDatasheet?partID=110217&src-supplier=Verical; ComponentLink6URL: http://www.farnell.com/datasheets/2304409.pdf?src-supplier=Element14; ComponentLink6Description: http://www.farnell.com/datasheets/2304409.pdf?src-supplier=Element14; Supplier 2: Mouser; Stock 2: 0; Supplier 3: Arrow; Stock 3: 5700; Pricing 3: 1=0.1933, 10=0.1873, 25=0.1555, 100=0.0806, 250=0.0724, 500=0.0523, 1000=0.0428, 3000=0.0342 (USD); Supplier Part Number 1: BAV99FSCT-ND; Supplier Part Number 2: 512-BAV99; Supplier Part Number 3: BAV99
J10 = Hed4: Header 4 (Green); Value: Header 4
J11 J12 = Con4: Connector 4; Value: Connector 4
J13 = Con2: Connector 2; Value: Connector 2
J14 = Header3: Header IDC, 3 x 1 Pin Vertical 2.54mm Pitch (Non-Boxed, Male); Manufacturer: W¨¹rth Elektronik eiSos GmbH; partNo: 613002143121; ComponentLink1 Description: Manufacturer; ComponentLink2 Description: Datasheet; NoPins: 02; Created Date: 29 March 2013; ComponentLink1URL: http://www.we-online.com; ComponentLink2URL: http://katalog.we-online.de/em/datasheet/6130xx143121.pdf; Created by: Karrer Zheng
J15 = DHT11: Manufacturer: W¨¹rth Elektronik eiSos GmbH; partNo: 613004143121; ComponentLink1 Description: Manufacturer; ComponentLink2 Description: Datasheet; NoPins: 04; Created Date: 29 March 2013; ComponentLink1URL: http://www.we-online.com; ComponentLink2URL: http://katalog.we-online.de/em/datasheet/6130xx143121.pdf; Created by: Karrer Zheng
R54 R56 R58 R59 = RM: Resistor SMD; Value: 1K
R55 R57 = RM: Resistor SMD; Value: 1K
U13 = PC817: Single Opto; Value: PC817

## Nets that join several sheets
+3V3: [01] Power Suppy (C18.2 U3.2 U3.4), [04] EEPROM_FLASH (L4.1), [05] RTC_RS232_USB (FB3.1), [07] RFID_LCD (FB4.1 FB5.1), [02] MCU (FB1.1 R14.2), [06] IN_OUT_SENSOR (D13.2 R54.2)
+3V3_GPS: [01] Power Suppy (C8.2 U1.5), [03] GSM_GPRS_GPS (FB2.1)
+4V_GSM: [01] Power Suppy (D2.2 D5.1), [03] GSM_GPRS_GPS (7 pins), [02] MCU (R16.2)
+5V: [01] Power Suppy (7 pins), [06] IN_OUT_SENSOR (5 pins)
+12V: [01] Power Suppy (5 pins), [06] IN_OUT_SENSOR (D12.1 J12.1 U13.1)
+VDC_INPUT: [01] Power Suppy (F1.1), [06] IN_OUT_SENSOR (J10.1)
GND: [01] Power Suppy (32 pins), [03] GSM_GPRS_GPS (43 pins), [04] EEPROM_FLASH (C48.1 U10.2 U10.3 U10.4), [05] RTC_RS232_USB (C50.1 R53.1 U12.5), [07] RFID_LCD (LCD1.1 RFID1.6), [02] MCU (33 pins), [06] IN_OUT_SENSOR (13 pins)
GND_INPUT: [01] Power Suppy (C3.1 L1.1), [06] IN_OUT_SENSOR (J10.2)
ADC_VIN_BAT: [02] MCU (U6.9), [06] IN_OUT_SENSOR (C52.2 D13.3 R57.2 R58.2)
Ctrl_PWR_GPS: [01] Power Suppy (R6.2), [02] MCU (U6.50)
Ctrl_PWR_GSM: [01] Power Suppy (R10.1), [02] MCU (U6.62)
DATA_IN1: [02] MCU (U6.8), [06] IN_OUT_SENSOR (C51.1 R54.1 U13.4)
DHT11_IN: [02] MCU (U6.10), [06] IN_OUT_SENSOR (J15.2 R59.1)
DS18B20_IN: [02] MCU (U6.11), [06] IN_OUT_SENSOR (J14.2 R56.1)
GPS_RST: [03] GSM_GPRS_GPS (R32.1), [02] MCU (U6.25)
GPS_RXD: [03] GSM_GPRS_GPS (U8.2), [02] MCU (U6.52)
GPS_TXD: [03] GSM_GPRS_GPS (U8.3), [02] MCU (U6.51)
GSM_DIR: [03] GSM_GPRS_GPS (R25.1), [02] MCU (U6.38)
GSM_LED_STATUS: [03] GSM_GPRS_GPS (Q6.2), [02] MCU (LED3.2)
GSM_PWRKEY: [03] GSM_GPRS_GPS (R23.1), [02] MCU (U6.39)
GSM_RXD: [03] GSM_GPRS_GPS (R27.1), [02] MCU (U6.43)
GSM_STATUS: [03] GSM_GPRS_GPS (R42.2), [02] MCU (U6.40)
GSM_TXD: [03] GSM_GPRS_GPS (R29.1), [02] MCU (U6.42)
LCD_SCL: [07] RFID_LCD (LCD1.3), [02] MCU (U6.59)
LCD_SDA: [07] RFID_LCD (LCD1.4), [02] MCU (U6.58)
RFID_MISO: [07] RFID_LCD (RFID1.4), [02] MCU (U6.23)
RFID_MOSI: [07] RFID_LCD (RFID1.3), [02] MCU (U6.22)
RFID_RST: [07] RFID_LCD (RFID1.7), [02] MCU (U6.24)
RFID_SCK: [07] RFID_LCD (RFID1.2), [02] MCU (U6.21)
RFID_SS: [07] RFID_LCD (RFID1.1), [02] MCU (U6.20)
ROM_SCL: [04] EEPROM_FLASH (R45.2 U10.6), [02] MCU (U6.29)
ROM_SDA: [04] EEPROM_FLASH (R44.2 U10.5), [02] MCU (U6.30)
ROM_WP: [04] EEPROM_FLASH (U10.7), [02] MCU (U6.27)
RS485_DIR: [05] RTC_RS232_USB (R53.2 U12.2 U12.3), [02] MCU (U6.15)
RS485_RX: [05] RTC_RS232_USB (R49.1 U12.1), [02] MCU (U6.17)
RS485_TX: [05] RTC_RS232_USB (U12.4), [02] MCU (U6.16)